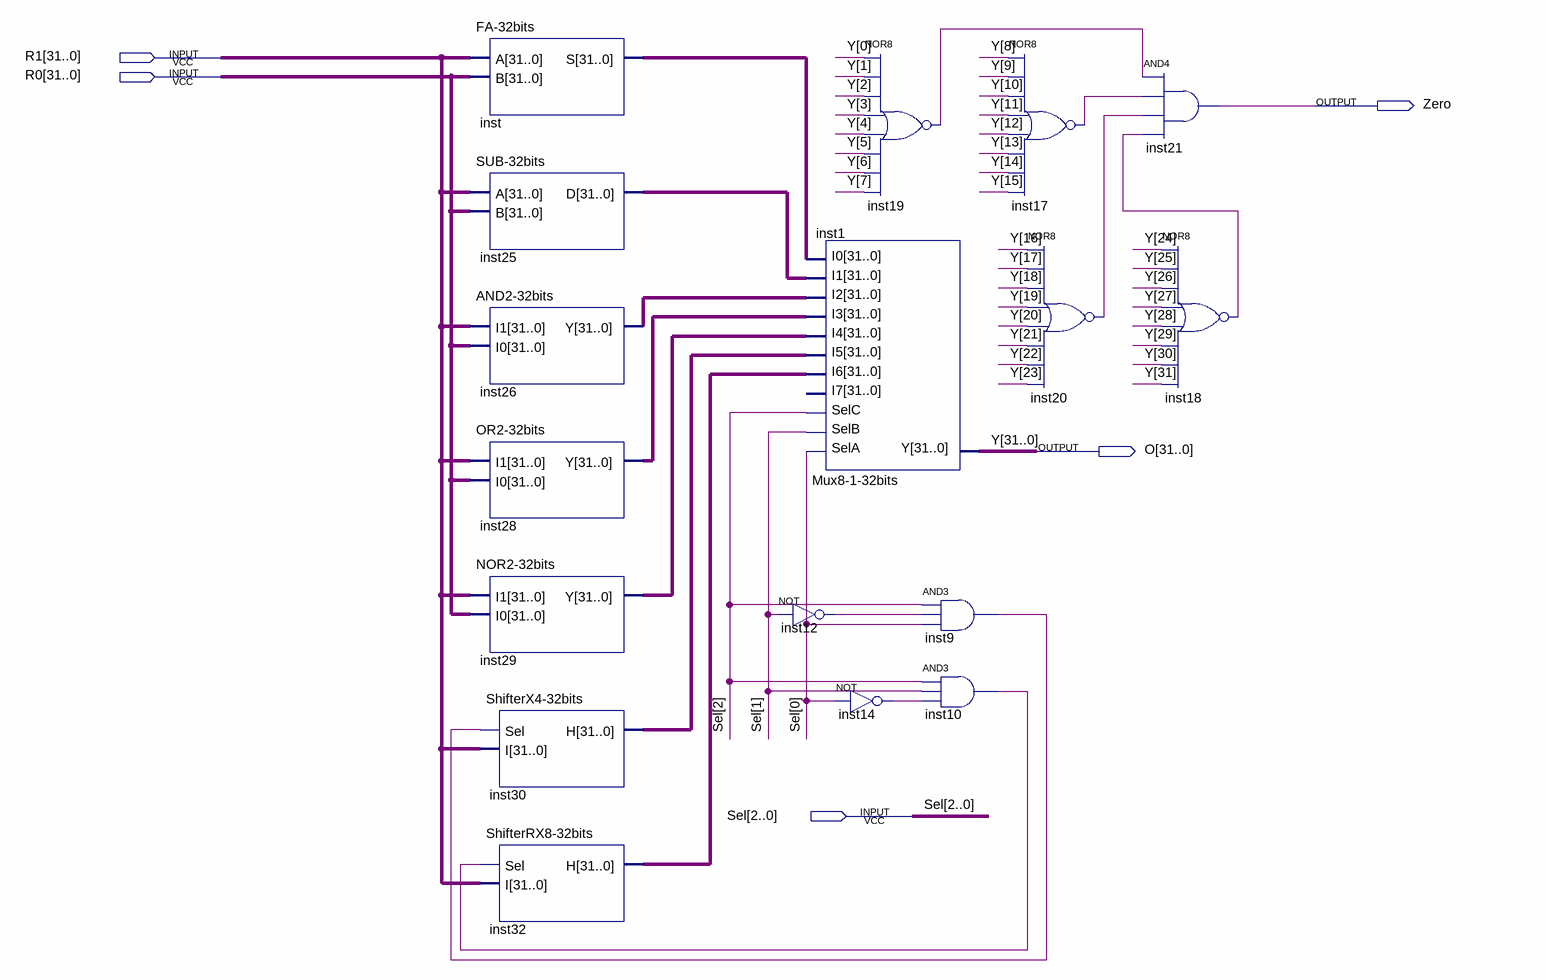
[diagram p0: schematic sheet]
// Quartus schematic ALU32bits.bdf as structural Verilog: 17 symbols, 5 pins
module ALU32bits (
  input  [31:0] R1,
  input  [31:0] R0,
  input  [2:0] Sel,
  output Zero,
  output [31:0] O
);

  wire inst9_out, inst10_out, inst12_out, inst14_out, inst17_out, inst18_out, inst19_out, inst20_out;
  wire [31:0] inst25_d, inst26_y, inst28_y, inst29_y, inst30_h, inst32_h, inst_s;

  \FA-32bits  inst (.A(R1), .B(R0), .S(inst_s));
  \SUB-32bits  inst25 (.A(R1), .B(R0), .D(inst25_d));
  \AND2-32bits  inst26 (.I1(R1), .I0(R0), .Y(inst26_y));
  \OR2-32bits  inst28 (.I1(R1), .I0(R0), .Y(inst28_y));
  \NOR2-32bits  inst29 (.I1(R1), .I0(R0), .Y(inst29_y));
  \ShifterX4-32bits  inst30 (.Sel(inst9_out), .I(R1), .H(inst30_h));
  \ShifterRX8-32bits  inst32 (.Sel(inst10_out), .I(R1), .H(inst32_h));
  \Mux8-1-32bits  inst1 (
    .SelA(Sel[0]), .SelB(Sel[1]), .SelC(Sel[2]), .I6(inst32_h), .I5(inst30_h), .I4(inst29_y), .I3(inst28_y),
    .I2(inst26_y), .I1(inst25_d), .I0(inst_s), .Y(O));  // open: I7
  not inst12 (inst12_out, Sel[1]);
  nor inst19 (inst19_out, O[0], O[1], O[2], O[3], O[4], O[5], O[6], O[7]);
  not inst14 (inst14_out, Sel[0]);
  and inst9 (inst9_out, Sel[2], inst12_out, Sel[0]);
  and inst10 (inst10_out, Sel[2], Sel[1], inst14_out);
  nor inst17 (inst17_out, O[8], O[9], O[10], O[11], O[12], O[13], O[14], O[15]);
  nor inst20 (inst20_out, O[16], O[17], O[18], O[19], O[20], O[21], O[22], O[23]);
  and inst21 (Zero, inst19_out, inst17_out, inst20_out, inst18_out);
  nor inst18 (inst18_out, O[24], O[25], O[26], O[27], O[28], O[29], O[30], O[31]);

  // Other names for the same wires on the sheet: Y[31:0] = O
endmodule
